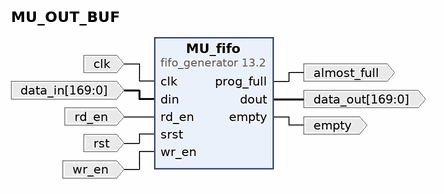
[diagram p0: block diagram of the top level]
# Vivado block design MU_OUT_BUF, xcu280-fsvh2892-2L-e, Vivado 2021.2
create_bd_design MU_OUT_BUF

create_bd_port -dir O almost_full
create_bd_port -dir I -type clk clk
create_bd_port -dir I -from 169 -to 0 data_in
create_bd_port -dir O -from 169 -to 0 data_out
create_bd_port -dir O empty
create_bd_port -dir I rd_en
create_bd_port -dir I rst
create_bd_port -dir I wr_en

create_bd_cell -type ip -vlnv xilinx.com:ip:fifo_generator:13.2 MU_fifo
set_property -dict [list \
  CONFIG.Full_Threshold_Assert_Value 500 \
  CONFIG.Input_Data_Width 170 \
  CONFIG.Input_Depth 512 \
  CONFIG.Performance_Options First_Word_Fall_Through \
  CONFIG.Programmable_Full_Type Single_Programmable_Full_Threshold_Constant \
  CONFIG.Use_Embedded_Registers true \
] [get_bd_cells MU_fifo]

# ---- connections ----

connect_bd_net -net clk_0_1 [get_bd_ports clk] [get_bd_pins MU_fifo/clk]
connect_bd_net -net din_0_1 [get_bd_ports data_in] [get_bd_pins MU_fifo/din]
connect_bd_net -net frc_fifo_dout [get_bd_pins MU_fifo/dout] [get_bd_ports data_out]
connect_bd_net -net frc_fifo_empty [get_bd_pins MU_fifo/empty] [get_bd_ports empty]
connect_bd_net -net frc_fifo_prog_full [get_bd_pins MU_fifo/prog_full] [get_bd_ports almost_full]
connect_bd_net -net rd_en_0_1 [get_bd_ports rd_en] [get_bd_pins MU_fifo/rd_en]
connect_bd_net -net srst_0_1 [get_bd_ports rst] [get_bd_pins MU_fifo/srst]
connect_bd_net -net wr_en_0_1 [get_bd_ports wr_en] [get_bd_pins MU_fifo/wr_en]

validate_bd_design
save_bd_design
